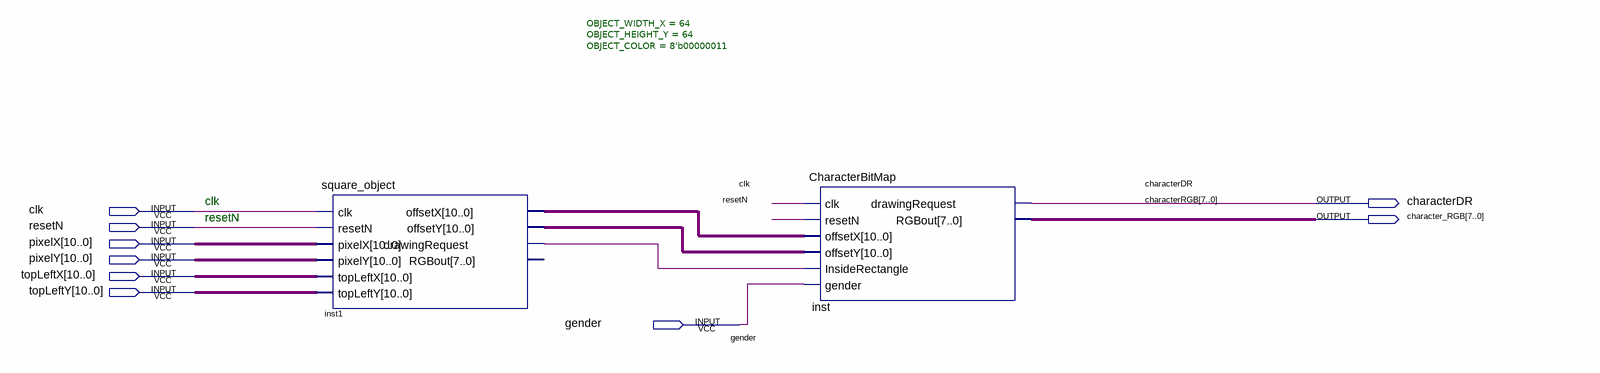
[diagram p0: schematic sheet]
// Quartus schematic Character_Top.bdf as structural Verilog: 2 symbols, 9 pins
module Character_Top (
  input  clk,
  input  resetN,
  input  [10:0] pixelX,
  input  [10:0] pixelY,
  input  [10:0] topLeftX,
  input  [10:0] topLeftY,
  input  gender,
  output characterDR,
  output [7:0] character_RGB
);

  wire inst1_drawingrequest;
  wire [10:0] inst1_offsetx, inst1_offsety;

  square_object #(.OBJECT_WIDTH_X(64), .OBJECT_HEIGHT_Y(64), .OBJECT_COLOR(8'b00000011)) inst1 (
    .clk(clk), .resetN(resetN), .pixelX(pixelX), .pixelY(pixelY), .topLeftX(topLeftX), .topLeftY(topLeftY),
    .offsetX(inst1_offsetx), .offsetY(inst1_offsety), .drawingRequest(inst1_drawingrequest));  // open: RGBout
  CharacterBitMap inst (
    .clk(clk), .resetN(resetN), .offsetX(inst1_offsetx), .offsetY(inst1_offsety),
    .InsideRectangle(inst1_drawingrequest), .gender(gender), .drawingRequest(characterDR),
    .RGBout(character_RGB));

  // Other names for the same wires on the sheet: characterRGB[7:0] = character_RGB

  // Notes on the sheet:
  //   clk
  //   resetN
endmodule
